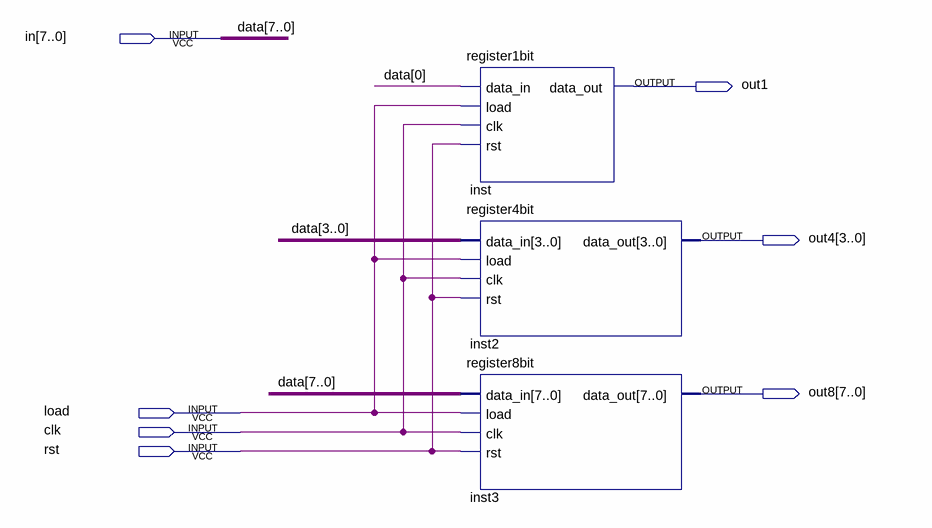
[diagram p0: schematic sheet]
// Quartus schematic test_register.bdf as structural Verilog: 3 symbols, 7 pins
module test_register (
  input  [7:0] in,
  input  load,
  input  clk,
  input  rst,
  output out1,
  output [3:0] out4,
  output [7:0] out8
);

  register1bit inst (.data_in(in[0]), .load(load), .clk(clk), .rst(rst), .data_out(out1));
  register4bit inst2 (.data_in(in[3:0]), .load(load), .clk(clk), .rst(rst), .data_out(out4));
  register8bit inst3 (.data_in(in), .load(load), .clk(clk), .rst(rst), .data_out(out8));

  // Other names for the same wires on the sheet: data[7:0] = in
endmodule
